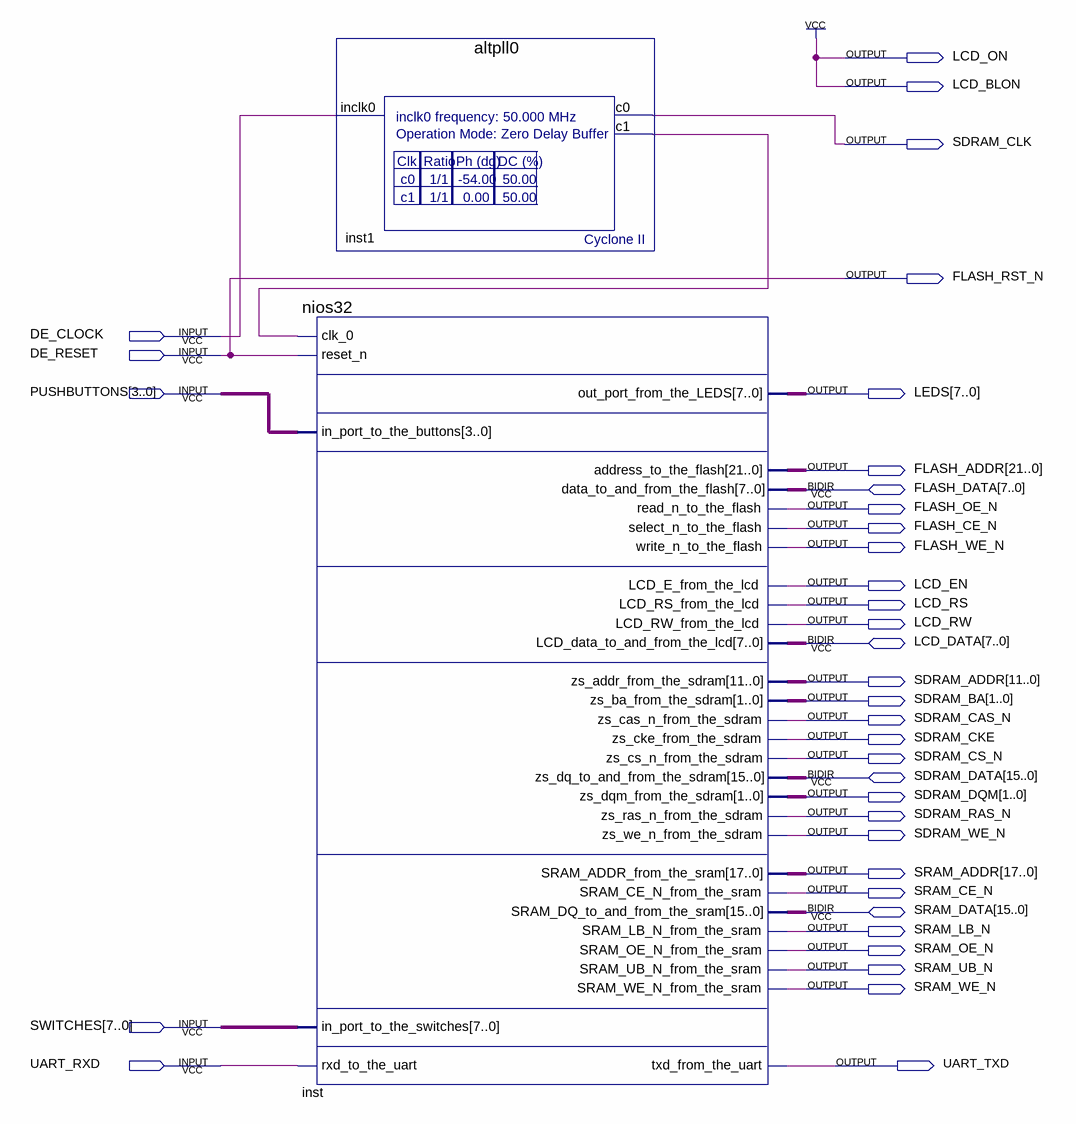
[diagram p0: schematic sheet]
// Quartus schematic rpds17.bdf as structural Verilog: 2 symbols, 36 pins
module rpds17 (
  input  DE_CLOCK,
  input  DE_RESET,
  input  [3:0] PUSHBUTTONS,
  input  [7:0] SWITCHES,
  input  UART_RXD,
  inout  [7:0] FLASH_DATA,
  inout  [7:0] LCD_DATA,
  inout  [15:0] SDRAM_DATA,
  inout  [15:0] SRAM_DATA,
  output LCD_ON,
  output LCD_BLON,
  output SDRAM_CLK,
  output FLASH_RST_N,
  output [7:0] LEDS,
  output [21:0] FLASH_ADDR,
  output FLASH_OE_N,
  output FLASH_CE_N,
  output FLASH_WE_N,
  output LCD_EN,
  output LCD_RS,
  output LCD_RW,
  output [11:0] SDRAM_ADDR,
  output [1:0] SDRAM_BA,
  output SDRAM_CAS_N,
  output SDRAM_CKE,
  output SDRAM_CS_N,
  output [1:0] SDRAM_DQM,
  output SDRAM_RAS_N,
  output SDRAM_WE_N,
  output [17:0] SRAM_ADDR,
  output SRAM_CE_N,
  output SRAM_LB_N,
  output SRAM_OE_N,
  output SRAM_UB_N,
  output SRAM_WE_N,
  output UART_TXD
);

  wire inst1_c1;

  nios32 inst (
    .clk_0(inst1_c1), .reset_n(DE_RESET), .in_port_to_the_buttons(PUSHBUTTONS),
    .in_port_to_the_switches(SWITCHES), .rxd_to_the_uart(UART_RXD), .out_port_from_the_LEDS(LEDS),
    .address_to_the_flash(FLASH_ADDR), .read_n_to_the_flash(FLASH_OE_N), .select_n_to_the_flash(FLASH_CE_N),
    .write_n_to_the_flash(FLASH_WE_N), .LCD_E_from_the_lcd(LCD_EN), .LCD_RS_from_the_lcd(LCD_RS),
    .LCD_RW_from_the_lcd(LCD_RW), .zs_addr_from_the_sdram(SDRAM_ADDR), .zs_ba_from_the_sdram(SDRAM_BA),
    .zs_cas_n_from_the_sdram(SDRAM_CAS_N), .zs_cke_from_the_sdram(SDRAM_CKE),
    .zs_cs_n_from_the_sdram(SDRAM_CS_N), .zs_dqm_from_the_sdram(SDRAM_DQM),
    .zs_ras_n_from_the_sdram(SDRAM_RAS_N), .zs_we_n_from_the_sdram(SDRAM_WE_N),
    .SRAM_ADDR_from_the_sram(SRAM_ADDR), .SRAM_CE_N_from_the_sram(SRAM_CE_N),
    .SRAM_LB_N_from_the_sram(SRAM_LB_N), .SRAM_OE_N_from_the_sram(SRAM_OE_N),
    .SRAM_UB_N_from_the_sram(SRAM_UB_N), .SRAM_WE_N_from_the_sram(SRAM_WE_N), .txd_from_the_uart(UART_TXD),
    .data_to_and_from_the_flash(FLASH_DATA), .LCD_data_to_and_from_the_lcd(LCD_DATA),
    .zs_dq_to_and_from_the_sdram(SDRAM_DATA), .SRAM_DQ_to_and_from_the_sram(SRAM_DATA));
  altpll0 inst1 (.inclk0(DE_CLOCK), .c0(SDRAM_CLK), .c1(inst1_c1));

  assign FLASH_RST_N = DE_RESET;
  assign LCD_BLON = 1'b1;
  assign LCD_ON = 1'b1;
endmodule
